# Altium schematic sheet RELAY11.SchDoc
size A
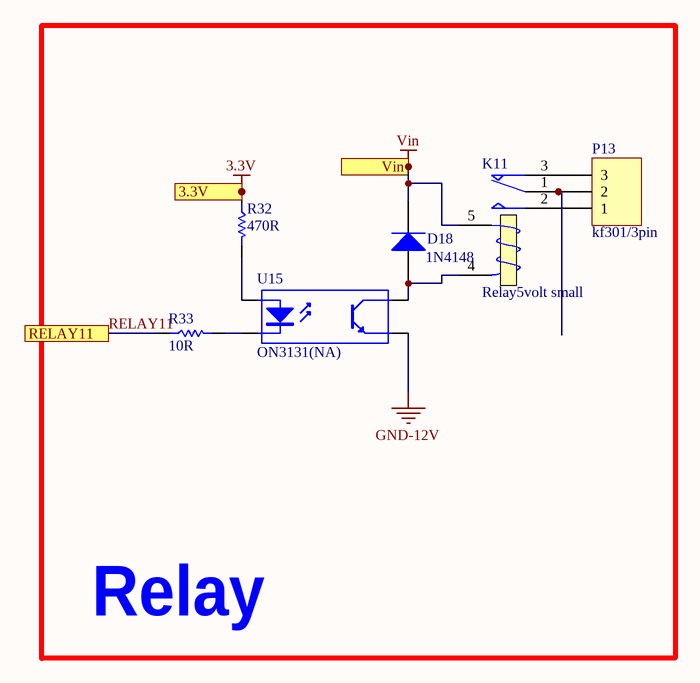
[diagram p0: RELAY11.SchDoc]

## Parts
D18  1N4148  [sod123]
K11  Relay5volt small  [relay5_childern]
P13  kf301/3pin  [Blue Connector 1*3 -kf301]
R32  470R  [0805/resistor]
R33  10R  [0805/resistor]
U15  ON3131(NA)  [OPTO_COUPLER]

## Blocks framed on the sheet
Relay: D18 K11 P13 R32 R33 U15

## Ports
3.3V, RELAY11, Vin

## Nets
3.3V: R32.1 ; port 3.3V
GND-12V: U15.3(E)
Vin: D18.K K11.5 ; port Vin
RELAY11: R33.1 ; port RELAY11
NetD18_A: D18.A K11.4(T2) U15.4(C)
NetK11_1: K11.1(COM) P13.2
NetK11_2: K11.2(NO) P13.1
NetK11_3: K11.3(T1) P13.3
NetR32_2: R32.2 U15.1(A)
NetR33_2: R33.2 U15.2(K)

## Library data of the parts
D18 = Diode 1N4007: 1 Amp General Purpose Rectifier; Published: 8-Jun-2000; LatestRevisionDate: 17-Jul-2002; LatestRevisionNote: Re-released for DXP Platform.; DatasheetVersion: 1998; PackageVersion: Aug-1999; PackageReference: DO-41; Publisher: Altium Limited; PackageDescription: Diode, Axial; Body 5.2 x 2.7 mm (LxDia. max), Lead Dia. 0.86 mm (max); Code_JEDEC: DO-204-AL; ComponentLink1Description: Manufacturer Link; ComponentLink1URL: http://www.fairchildsemi.com/; ComponentLink2Description: Datasheet; ComponentLink2URL: http://www.fairchildsemi.com/ds/1N%2F1N4001.pdf
K11 = Relay: SPDT Relay; Published: 8-Jun-2000; LatestRevisionDate: 17-Jul-2002; LatestRevisionNote: Re-released for DXP Platform.; PackageReference: MODULE5B; Publisher: Altium Limited
P13 = Header 3: LatestRevisionDate: 17-Jul-2002; LatestRevisionNote: Re-released for DXP Platform.; Publisher: Altium Limited
R32 R33 = Resistor: Tolerance: 5%; Power: 1/8 W
  R32: Value: 470R
  R33: Value: 10R
U15 = Optoisolator1: 4-Pin Phototransistor Optocoupler; Published: 24-Mar-1999; LatestRevisionDate: 04-Mar-2005; LatestRevisionNote: Sch pins 3 & 4 Swapped.; DatasheetVersion: Nov-2003; PackageReference: DIP-4; Publisher: Altium Limited